# Altium schematic sheet [8]O2-Flood.SchDoc: Edge device Sensor Board
size B; Organization: Latium Group of Companies; Address1: 1312 10 St; Address2: Nisku, Alberta, Canada; Address3: T9E 8K2; Revision: 1.1; SheetNumber: 1; SheetTotal: 1
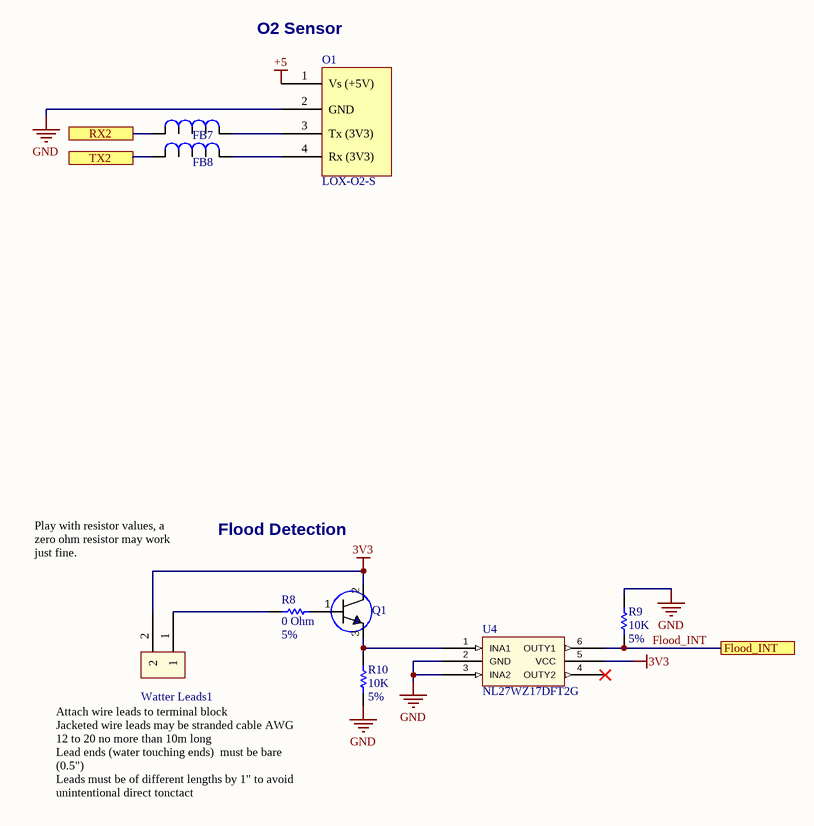
[diagram p0: [8]O2-Flood.SchDoc]

## Parts
FB7  BLM18AG102SN1D  [Ferrite Bead]  (value not drawn)
FB8  BLM18AG102SN1D  [Ferrite Bead]  (value not drawn)
O1  LOX-O2-S  [LuminOx O2 Sensors]
Q1  PNP General Purpose SMD  [SOT-89 (MPT3)]  (value not drawn)
R8  value 0 Ohm  Tolerance: 5%  [RES 0603]  (hidden comment: RES 0 Ohm 5% 0.1W [0603])
R9  value 10K  Tolerance: 5%  [RES 0603]  (hidden comment: RES 10K 5% 0.1W [0603])
R10  value 10K  Tolerance: 5%  [RES 0603]  (hidden comment: RES 10K 5% 0.1W [0603])
U4  PN: NL27WZ17DFT2G  [SC-88]  (hidden comment: Schmitt Trigger Buffer,  Dual, Non-Inverting)
Watter_Leads1  TRM BLCK 1x2  [TRM BLCK Pitch 5mm 2Pos]  (value not drawn)

## Ports
Flood_INT, RX2, TX2

## Nets
3V3: Q1.2(COLLECTOR) U4.5(VCC) Watter_Leads1.2
+5: O1.1(Vs_(+5V))
GND: O1.2(GND) R9.2 R10.1 U4.2(GND) U4.3(INA2)
Flood_INT: R9.1 U4.6(OUTY1) ; port Flood_INT
RX2: FB7.1 ; port RX2
TX2: FB8.1 ; port TX2
NetFB7_2: FB7.2 O1.3(Tx_(3V3))
NetFB8_2: FB8.2 O1.4(Rx_(3V3))
NetQ1_1: Q1.1(BASE) R8.2
NetQ1_3: Q1.3(EMITTER) R10.2 U4.1(INA1)
NetR8_1: R8.1 Watter_Leads1.1

Not connected (* = marked no-connect by the designer): U4 4(OUTY2)*

## Notes on the sheet
- (near O1) O2 Sensor
- Play with resistor values, a zero ohm resistor may work just fine.
- Flood Detection
- Attach wire leads to terminal block
  Jacketed wire leads may be stranded cable AWG  12 to 20 no more than 10m long
  Lead ends (water touching ends)  must be bare (0.5")
  Leads must be of different lengths by 1" to avoid unintentional direct tonctact
- Title
- Size:
- Date:
- Tabloid
- Number:
- Time:
- Revision:
- Sheet
- of
- File:

## Library data of the parts
FB7 FB8 = Ferrite Bead: Ferrite Bead 1KOhm @100MHz; Datasheet: https://www.murata.com/en-us/products/productdata/8796738650142/ENFA0003.pdf?src-supplier=Digi-Key; Supplier 1: Mouser; Supplier Part Number 1: 81-BLM11A102S; PN: BLM18AG102SN1D
Q1 = PNP General Purpose SMD: PN: DTDG14GPT100; Supplier 1: Digi-Key; Supplier Part Number 1: DTDG14GPT100CT-ND; Datasheet: http://rohmfs.rohm.com/en/products/databook/datasheet/discrete/transistor/digital/dtdg14gpt100-e.pdf; Datasheet2: http://rohmfs.rohm.com/en/techdata_basic/transistor/taping/MPT3_T100_taping.pdf
R8 = RES 0 Ohm [0603]: PN: ERJ-3GEY0R00V; Supplier 1: Mouser; Supplier Part Number 1: 667-ERJ-3GEY0R00V; Datasheet: http://industrial.panasonic.com/cdbs/www-data/pdf/RDA0000/AOA0000C301.pdf?src-supplier=Farnell
R9 R10 = RES 10K 5% 0.1W [0603]: PN: CR0603-JW-103ELF; Supplier 1: Newark; Supplier Part Number 1: 84W7243
U4 = IC BUFFER NON-INVERT 5.5V SC88: Supplier 1: Digi-Key; Supplier Part Number 1: NL27WZ16DFT2GOSCT-ND; Datasheet: https://www.onsemi.com/pub/Collateral/NL27WZ17-D.PDF
Watter_Leads1 = TRM BLCK 1x2: TM Pitch 5mm 2A Screw; Manufacturer: Würth Elektronik; PN: 691137710002; Supplier 1: Digi-Key; Supplier Part Number 1: 732-10955-ND; Datasheet: https://www.we-online.de/katalog/datasheet/691137710002.pdf
O1 = LOX-O2-S: Datasheet: https://www.sstsensing.com/wp-content/uploads/2019/07/DS0030rev14_LuminOx.pdf; URL: https://www.sstsensing.com/product/luminox-optical-oxygen-sensors-2/; Supplier: www.sstsensing.com; PN: LOX-O2-S